# EAGLE design RasPi-BplusHAT_CamSlot (EAGLE 6.6.0)
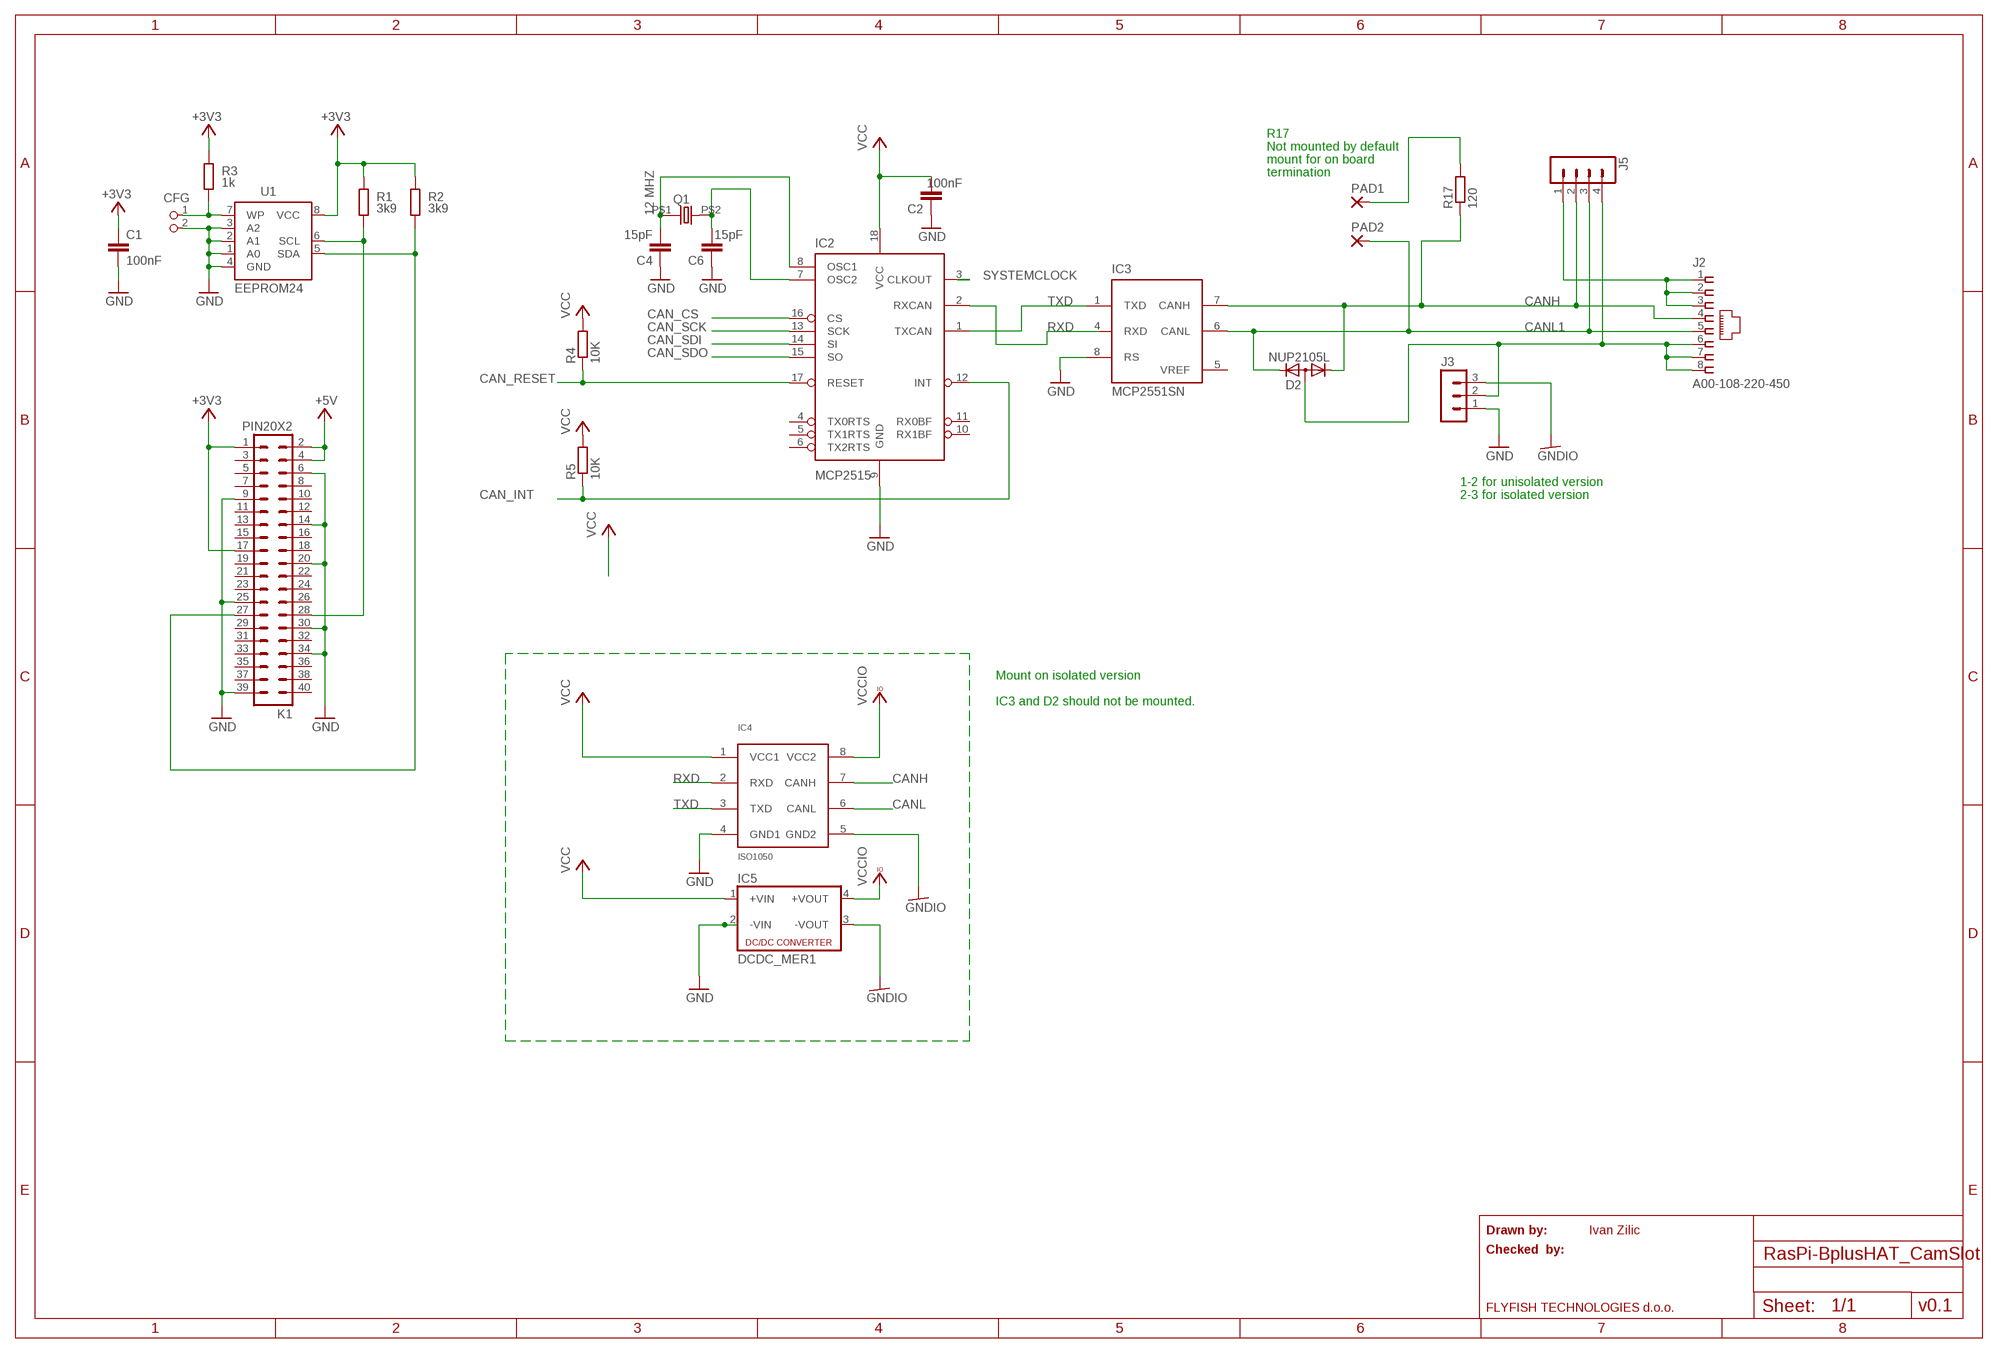
[diagram p0: schematic, sheet 1]

## Parts
C1  100nF  C-EUC0805K  [C0805K]
C2  100nF  C-EUC0805  [C0805]
C4  15pF  C-EUC0805  [C0805]
C6  15pF  C-EUC0805  [C0805]
CFG  PIN2_100  [PIN_W_2]
D2  NUP2105L  DIODE-2CA|ACSOT23  [SOT23]
IC2  MCP2515  [SO-18W]
IC3  MCP2551SN  [SO-08]
IC4  ISO1050  [DUB_PSOP]
IC5  DCDC_MER1  [MER1]
J2  A00-108-220-450  [RJ-45]
J3  MA03-1  [MA03-1]
J5  MA04-1  [MA04-1]
K1  PIN20X2  [PIN_20X2]
PAD1  1,6/0,8  [1,6/0,8]
PAD2  1,6/0,8  [1,6/0,8]
Q1  12 MHZ  HC-49S  [9C]
R1  3k9  R-EU_M0805  [M0805]
R2  3k9  R-EU_M0805  [M0805]
R3  1k  R-EU_M0805  [M0805]
R4  10K  R-EU_R0805  [R0805]
R5  10K  R-EU_R0805  [R0805]
R17  120  R-EU_R0805  [R0805]
U1  EEPROM24  [SOIC8]

## Nets
+3V3: C1.1 K1.1 K1.17 R1.2 R2.2 R3.2 U1.8(VCC)
+5V: K1.2 K1.4
CAN_CS: IC2.16(CS)
CAN_INT: IC2.12(INT) R5.1
CAN_RESET: IC2.17(RESET) R4.1
CAN_SCK: IC2.13(SCK)
CAN_SDI: IC2.14(SI)
CAN_SDO: IC2.15(SO)
CANH: D2.1(K1) IC3.7(CANH) IC4.7(CANH) J2.4 J5.2 R17.1
CANL: IC4.6(CANL)
CANL1: D2.2(K2) IC3.6(CANL) J2.5 J5.3 PAD2.1(P)
GND: C1.2 C2.1 C4.1 C6.1 CFG.2 IC2.9(GND) IC3.8(RS) IC4.4(GND1) IC5.2(-VIN) J3.1 K1.6 K1.9 K1.14 K1.20 K1.25 K1.30 K1.34 K1.39 U1.1(A0) U1.2(A1) U1.3(A2) U1.4(GND)
GNDIO: IC4.5(GND2) IC5.3(-VOUT) J3.3
N$1: K1.28 R1.1 U1.6(SCL)
N$2: K1.27 R2.1 U1.5(SDA)
N$3: CFG.1 R3.1 U1.7(WP)
N$4: C4.2 IC2.8(OSC1) Q1.P$1
N$7: C6.2 IC2.7(OSC2) Q1.P$2
N$9: D2.3(A) J2.6 J2.7 J2.8 J3.2 J5.4
N$11: PAD1.1(P) R17.2
N$12: J2.1 J2.2 J2.3 J5.1
RXD: IC2.2(RXCAN) IC4.2(RXD)
SYSTEMCLOCK: IC2.3(CLKOUT)
TXD: IC2.1(TXCAN) IC3.1(TXD) IC4.3(TXD)
VCC: C2.2 IC2.18(VCC) IC4.1(VCC1) IC5.1(+VIN) R4.2 R5.2
VCCIO: IC4.8(VCC2) IC5.4(+VOUT)
Unconnected: IC2.4(TX0RTS) IC2.5(TX1RTS) IC2.6(TX2RTS) IC2.10(RX1BF) IC2.11(RX0BF) IC3.4(RXD) K1.3 K1.5 K1.7 K1.8 K1.10 K1.11 K1.12 K1.13 K1.15 K1.16 K1.18 K1.19 K1.21 K1.22 K1.23 K1.24 K1.26 K1.29 K1.31 K1.32 K1.33 K1.35 K1.36 K1.37 K1.38 K1.40

## Notes on the sheet
- R17
- Not mounted by default
- mount for on board
- termination
- 1-2 for unisolated version
- 2-3 for isolated version
- Mount on isolated version
- IC3 and D2 should not be mounted.
- Drawn by: | Ivan Zilic
- Checked  by:
- FLYFISH TECHNOLOGIES d.o.o. | v0.1

## Power pins joined to a net without a drawn wire
VDD: IC3.3(VDD)
VREF: IC3.5(VREF)
VSS: IC3.2(VSS)

## Library data of the parts
C1 = resistor:C-EU: CAPACITOR, European symbol; DIELECTRIC: X7R
C2 C4 C6 = rcl:C-EU: CAPACITOR, European symbol
CFG = FLYFISH:PIN2
D2 = diode:DIODE-2CA|AC: Dual DIODE Cathode-Anode|Anode-Cathode
IC2 = vscpcan:MCP2515
IC3 = microchip_can:MCP2551: High Speed CAN tranceiver
IC4 = vscpcan:ISO1050
IC5 = vscpcan:DCDC_MER1
J2 = vscpcan:A00-108-220-450
J3 = con-lstb:MA03-1: PIN HEADER; OC_FARNELL: unknown; OC_NEWARK: unknown
J5 = con-lstb:MA04-1: PIN HEADER; OC_FARNELL: unknown; OC_NEWARK: unknown
K1 = FLYFISH:PIN20X2
PAD1 PAD2 = wirepad:1,6/0,8: THROUGH-HOLE PAD
Q1 = vscpcan:HC-49S: Digikey 887-1050-1-nd
R1-R3 = resistor:R-EU_: RESISTOR, European symbol; TOLERANCE: 5%
R4 R5 R17 = rcl:R-EU_: RESISTOR, European symbol
U1 = FLYFISH:EEPROM24

## Board
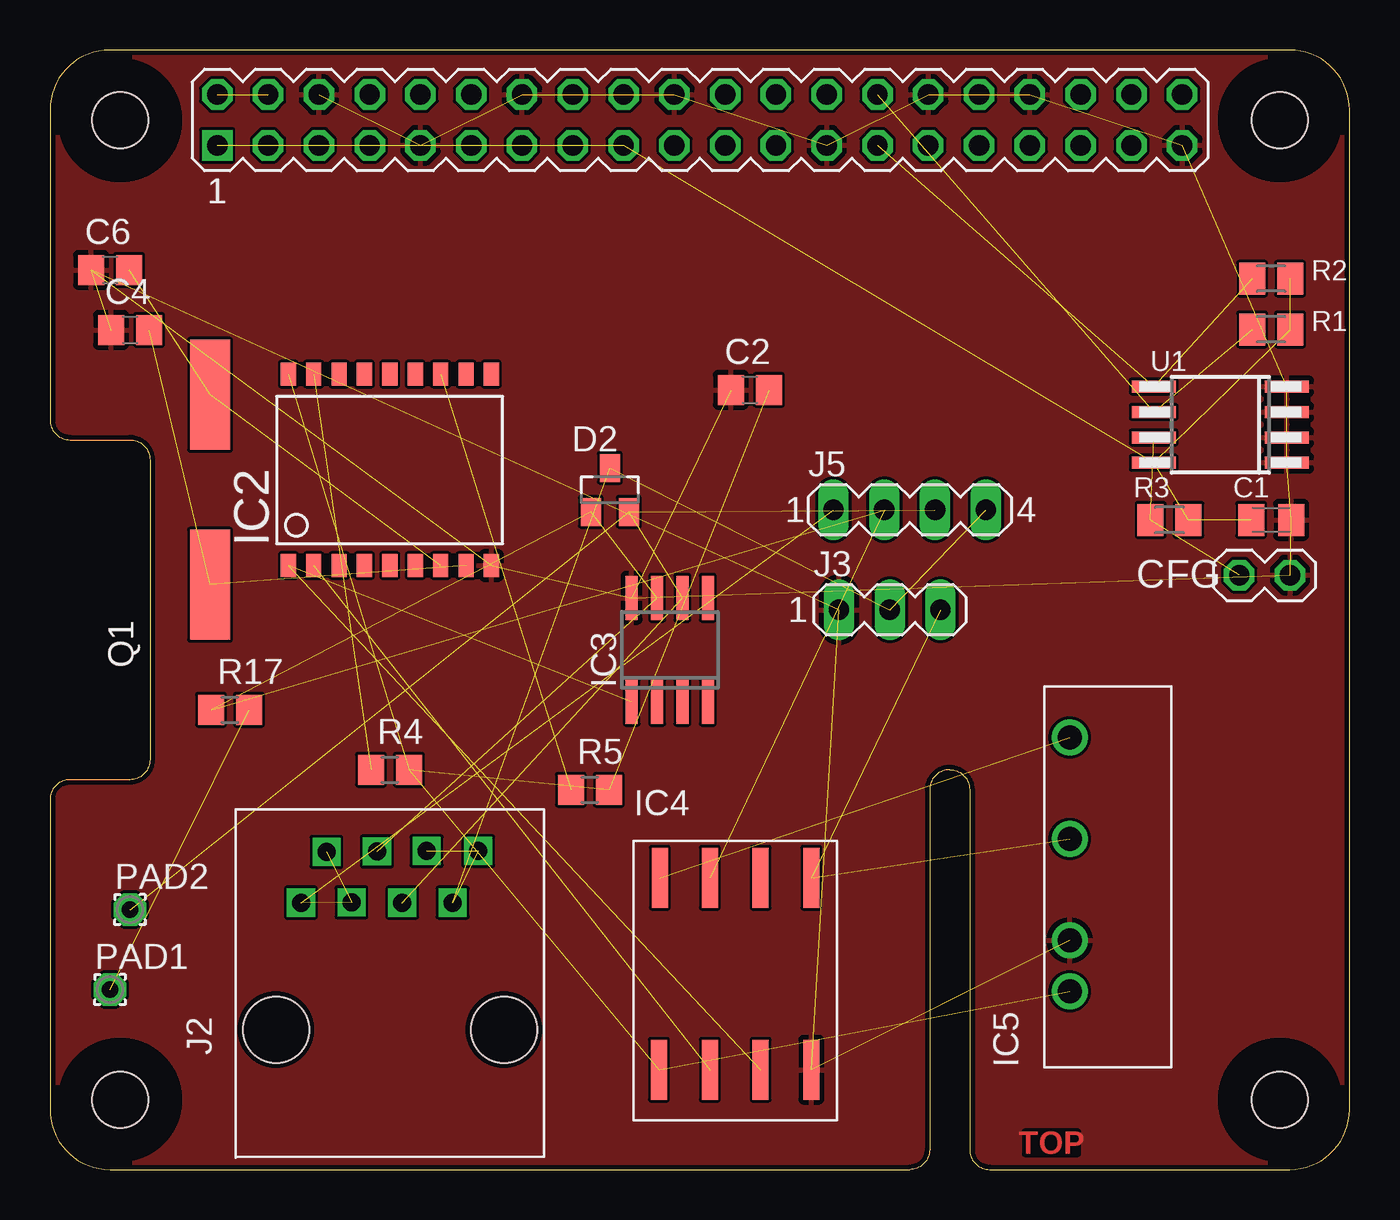
[diagram p1: board, top side]
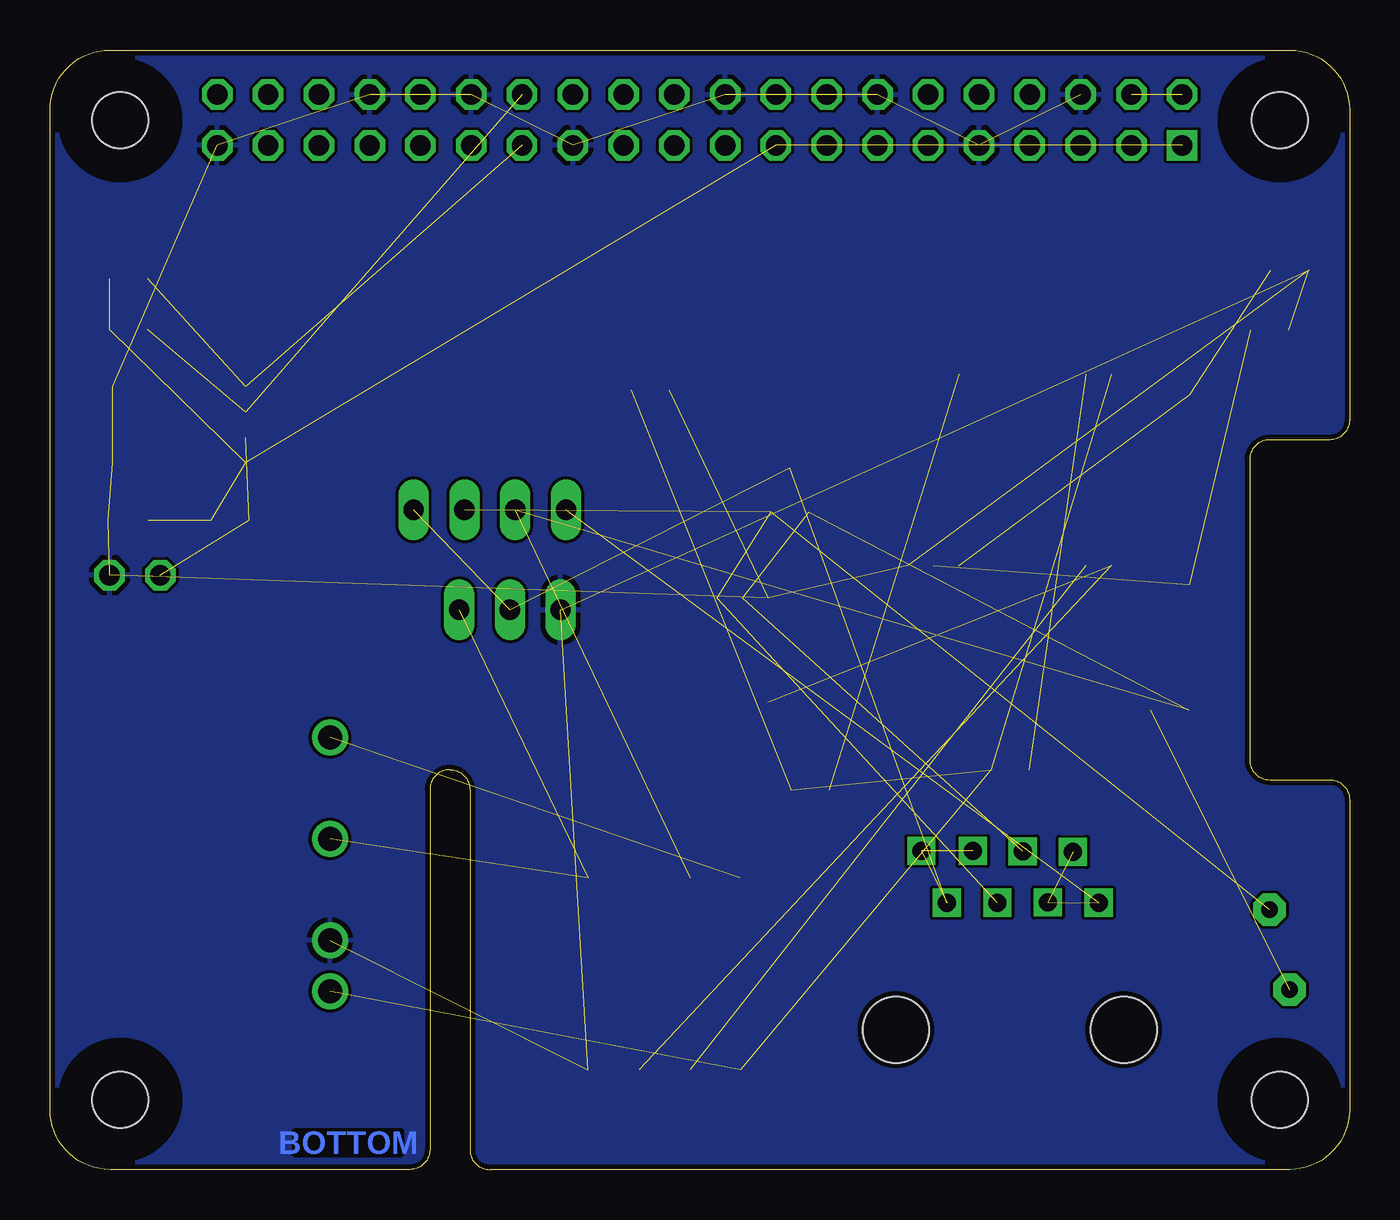
[diagram p2: board, bottom side, seen from below]

Size 65 x 56 mm. Coordinates in mm from the lower left corner, seen from the top.
Outline: 0,3 arc90 3,0 43,0 arc90 44,1 44,19 arc-90 45,20 arc-90 46,19 46,1 arc90 47,0 62,0 arc90 65,3 65,53 arc90 62,56 3,56 arc90 0,53 0,37.5 arc90 1,36.5 4,36.5 arc-90 5,35.5 5,20.5 arc-90 4,19.5 1,19.5 arc90 0,18.5 0,3
Copper layers (1*16): Top 0.035mm / dielectric 1.5mm / Bottom 0.035mm
Design rules "ITEADstudio_DRC": minimum track width 6mil, minimum drill 12mil, track to track 6mil, track to pad 6mil, pad to pad 6mil, via to via 6mil, smd to smd 0mil, copper to edge 10mil, drill to drill 10mil, minimum pad ring 10mil, minimum via ring 6mil, stop-mask expansion 2mil, vias tented up to drill 100mil, thermal gap 10mil
Holes 2.8 mm at 3.5,3.5 3.5,52.5 61.5,52.5 61.5,3.5
tRestrict: area 1.9,51 to 5,54; area 60,51 to 63,54; area 60,1.9 to 63,5; area 1.9,1.9 to 5,5
bRestrict: area 1.9,1.9 to 5,5; area 1.9,51 to 5,54; area 60,1.9 to 63,5; area 60,51 to 63,54

### Footprints (pad centres in the part's own frame; a part is rotated, then mirrored left to right if it is on the bottom)
C0805K = smd 1.3 x 1.6: 1 -1,0; 2 1,0
C0805 = smd 1.3 x 1.5: 1 -0.95,0; 2 0.95,0
PIN_W_2 = drill 1.016 octagon: 1 0,0; 2 0,-2.54
SOT23 = smd 1 x 1.4: 1 -0.95,-1.1; 2 0.95,-1.1; 3 0,1.1
SO-18W = smd 0.762 x 1.143: 1 -5.08,-4.788; 2 -3.81,-4.788; 3 -2.54,-4.788; 4 -1.27,-4.788; 5 0,-4.788; 6 1.27,-4.788; 7 2.54,-4.788; 8 3.81,-4.788; 9 5.08,-4.788; 10 5.08,4.788; 11 3.81,4.788; 12 2.54,4.788; 13 1.27,4.788; 14 0,4.788; 15 -1.27,4.788; 16 -2.54,4.788; 17 -3.81,4.788; 18 -5.08,4.788
SO-08 = smd 0.6 x 2.2: 1 -1.905,-2.6; 2 -0.635,-2.6; 3 0.635,-2.6; 4 1.905,-2.6; 5 1.905,2.6; 6 0.635,2.6; 7 -0.635,2.6; 8 -1.905,2.6
DUB_PSOP = smd 0.8 x 3: 1 -2.54,0; 2 0,0; 3 2.54,0; 4 5.08,0; 5 5.08,9.6; 6 2.54,9.6; 7 0,9.6; 8 -2.5,9.6
MER1 = drill 1.2: 1 -5.08,0; 2 -2.54,0; 3 2.54,0; 4 7.62,0
RJ-45 = drill 0.9 square: 1 -4.45,6.35; 2 -3.17,8.89; 3 -1.92,6.36; 4 -0.65,8.91; 5 0.62,6.35; 6 1.84,8.93; 7 3.14,6.35; 8 4.42,8.93 | hole 3.3: -5.7,0; 5.7,0
MA03-1 = drill 1.016 long: 1 -2.54,0; 2 0,0; 3 2.54,0
MA04-1 = drill 1.016 long: 1 -3.81,0; 2 -1.27,0; 3 1.27,0; 4 3.81,0
PIN_20X2 = drill 1.016 square: 1 -24.13,-1.27 | drill 1.016 octagon: 2 -24.13,1.27; 3 -21.59,-1.27; 4 -21.59,1.27; 5 -19.05,-1.27; 6 -19.05,1.27; 7 -16.51,-1.27; 8 -16.51,1.27; 9 -13.97,-1.27; 10 -13.97,1.27; 11 -11.43,-1.27; 12 -11.43,1.27; 13 -8.89,-1.27; 14 -8.89,1.27; 15 -6.35,-1.27; 16 -6.35,1.27; 17 -3.81,-1.27; 18 -3.81,1.27; 19 -1.27,-1.27; 20 -1.27,1.27; 21 1.27,-1.27; 22 1.27,1.27; 23 3.81,-1.27; 24 3.81,1.27; 25 6.35,-1.27; 26 6.35,1.27; 27 8.89,-1.27; 28 8.89,1.27; 29 11.43,-1.27; 30 11.43,1.27; 31 13.97,-1.27; 32 13.97,1.27; 33 16.51,-1.27; 34 16.51,1.27; 35 19.05,-1.27; 36 19.05,1.27; 37 21.59,-1.27; 38 21.59,1.27; 39 24.13,-1.27; 40 24.13,1.27
1,6/0,8 = drill 0.813 pad 1.6 octagon: 1 0,0
9C = smd 5.5 x 2: P$1 -4.74,0; P$2 4.76,0
M0805 = smd 1.3 x 1.6: 1 -0.95,0; 2 0.95,0
R0805 = smd 1.3 x 1.5: 1 -0.95,0; 2 0.95,0
SOIC8 = smd 0.6 x 2.2: 1 -1.905,-3.33; 2 -0.635,-3.33; 3 0.635,-3.33; 4 1.905,-3.33; 5 1.905,3.33; 6 0.635,3.33; 7 -0.635,3.33; 8 -1.905,3.33

### Placement (x,y rotation side)
C1  61.08,32.5 0 top
C2  35,39 0 top
C4  4,42 0 top
C6  3,45 0 top
CFG  59.48,29.73 90 top
D2  28,34 0 top
IC2  17,35 0 top
IC3  31,26 0 top
IC4  33,5 0 top
IC5  51,14 90 top
J2  17,7 0 top
J3  42,28 0 top
J5  43,33 0 top
K1  32.5,52.5 0 top
PAD1  3,9 0 top
PAD2  4,13 0 top
Q1  8,34 90 top
R1  61.08,42.02 0 top
R2  61.08,44.56 0 top
R3  55.99,32.5 0 top
R4  17,20 0 top
R5  27,19 0 top
R17  9,23 0 top
U1  58.53,37.26 90 top

### Tracks (layer width: path | path; a pad name or v marks a point on that pad's centre or on a via)
+3V3  (6 unrouted)
+5V  (1 unrouted)
CAN_INT  (1 unrouted)
CAN_RESET  (1 unrouted)
CANH  (5 unrouted)
CANL1  (4 unrouted)
GND  (21 unrouted)
  pour Bottom: 0,3 arc90 3,0 43,0 arc90 44,1 44,19 arc-90 45,20 arc-90 46,19 46,1 arc90 47,0 62,0 arc90 65,3 65,53 arc90 62,56 3,56 arc90 0,53 0,37.5 arc90 1,36.5 4,36.5 arc-90 5,35.5 5,20.5 arc-90 4,19.5 1,19.5 arc90 0,18.5
  pour Top: 0,3 arc90 3,0 43,0 arc90 44,1 44,19 arc-90 45,20 arc-90 46,19 46,1 arc90 47,0 62,0 arc90 65,3 65,53 arc90 62,56 3,56 arc90 0,53 0,37.5 arc90 1,36.5 4,36.5 arc-90 5,35.5 5,20.5 arc-90 4,19.5 1,19.5 arc90 0,18.5
GNDIO  (2 unrouted)
N$1  (2 unrouted)
N$2  (2 unrouted)
N$3  (2 unrouted)
N$4  (2 unrouted)
N$7  (2 unrouted)
N$9  (5 unrouted)
N$11  (1 unrouted)
N$12  (3 unrouted)
RXD  (1 unrouted)
TXD  (2 unrouted)
VCC  (5 unrouted)
VCCIO  (1 unrouted)

### Text on the board
Top: TOP
Bottom: BOTTOM